# EAGLE schematic TestV1 (EAGLE 9.2.2)

## Sheet 1 of 9: Light Sensor Circuit
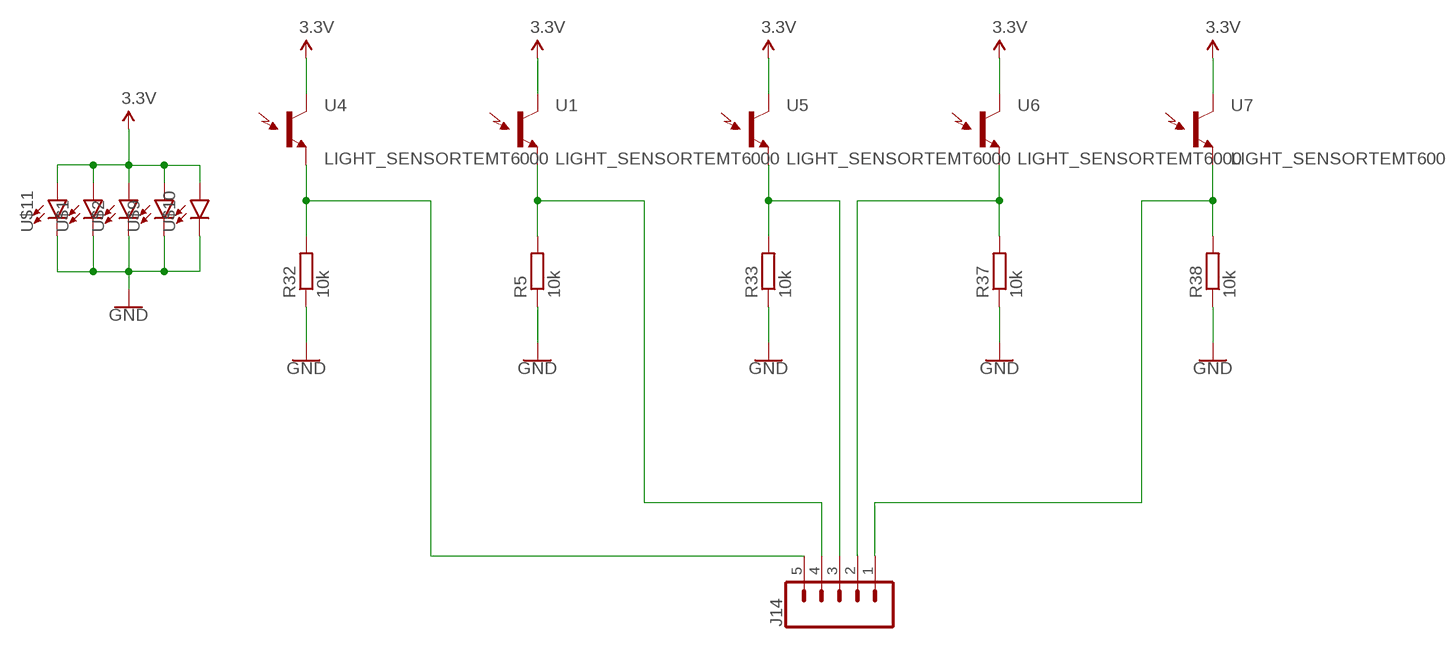
[diagram p0: schematic, sheet 1]

### Parts
J14  CONN_05LOCK  [1X05_LOCK]
R5  10k  R-EU_R0603  [R0603]
R32  10k  R-EU_R0603  [R0603]
R33  10k  R-EU_R0603  [R0603]
R37  10k  R-EU_R0603  [R0603]
R38  10k  R-EU_R0603  [R0603]
U1  LIGHT_SENSORTEMT6000  [TEMT6000]
U4  LIGHT_SENSORTEMT6000  [TEMT6000]
U5  LIGHT_SENSORTEMT6000  [TEMT6000]
U6  LIGHT_SENSORTEMT6000  [TEMT6000]
U7  LIGHT_SENSORTEMT6000  [TEMT6000]
U$1  3528LED  [3528]
U$2  3528LED  [3528]
U$9  3528LED  [3528]
U$10  3528LED  [3528]
U$11  3528LED  [3528]

### Nets
3.3V: U1.COLLECTOR(C1) U4.COLLECTOR(C1) U5.COLLECTOR(C1) U6.COLLECTOR(C1) U7.COLLECTOR(C1) U$1.A U$2.A U$9.A U$10.A U$11.A ; also sheet 2,3,4,6,7,8,9
GND: R5.1 R32.1 R33.1 R37.1 R38.1 U$1.C U$2.C U$9.C U$10.C U$11.C ; also sheet 2,3,4,5,6,7,8,9
N$65: J14.4 R5.2 U1.EMITTER(E1)
N$66: J14.3 R33.2 U5.EMITTER(E1)
N$67: J14.2 R37.2 U6.EMITTER(E1)
N$68: J14.1 R38.2 U7.EMITTER(E1)
N$69: J14.5 R32.2 U4.EMITTER(E1)

## Sheet 2 of 9: TPS5450 Buck Circuit
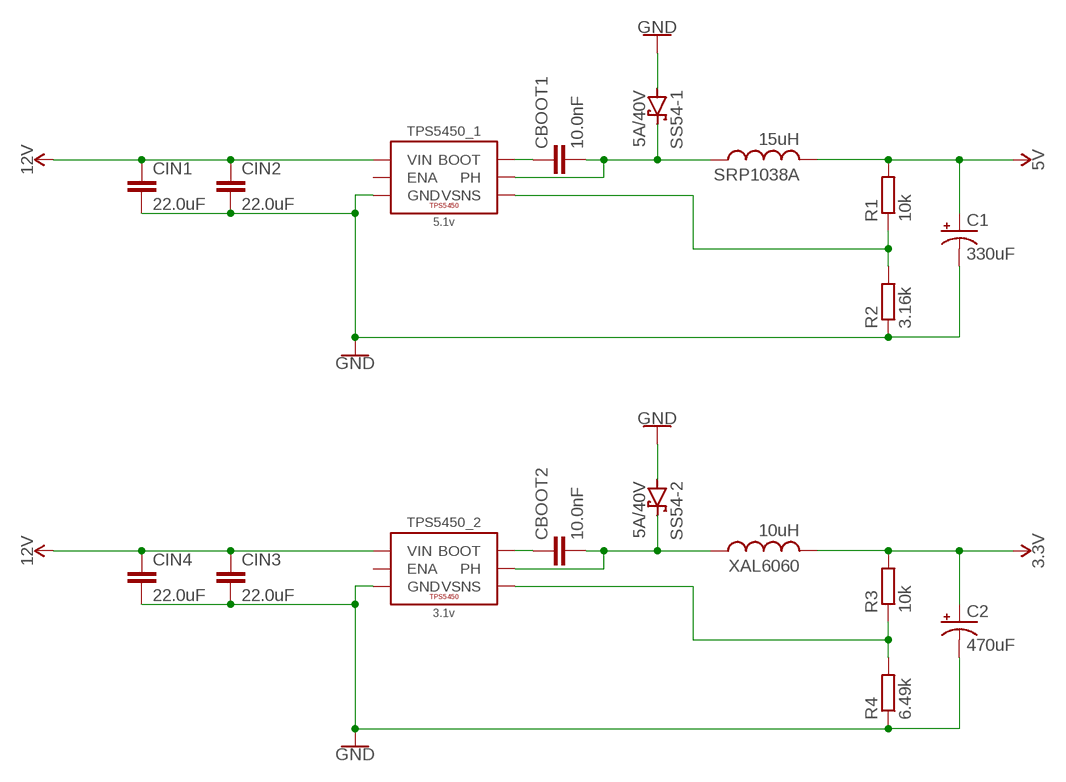
[diagram p1: schematic, sheet 2]

### Parts
C1  330uF  CPOL-USD/7343-31R  [D/7343-31R]
C2  470uF  CPOL-USD/7343-31R  [D/7343-31R]
CBOOT1  10.0nF  C-EUC0603  [C0603]
CBOOT2  10.0nF  C-EUC0603  [C0603]
CIN1  22.0uF  C-EUC1210  [C1210]
CIN2  22.0uF  C-EUC1210  [C1210]
CIN3  22.0uF  C-EUC1210  [C1210]
CIN4  22.0uF  C-EUC1210  [C1210]
R1  10k  R-EU_R0603  [R0603]
R2  3.16k  R-EU_R0603  [R0603]
R3  10k  R-EU_R0603  [R0603]
R4  6.49k  R-EU_R0603  [R0603]
SRP1038A  15uH  SRP1038A  [SRP1038A]
SS54-1  5A/40V  SCHOTTKY-DIODESMD  [SMB]
SS54-2  5A/40V  SCHOTTKY-DIODESMD  [SMB]
TPS5450_1  5.1v  TPS5450  [POWERPAD-SOIC-8]
TPS5450_2  3.1v  TPS5450  [POWERPAD-SOIC-8]
XAL6060  10uH  XAL6060  [XAL6060]

### Nets
3.3V: C2.+ R3.2 XAL6060.2 ; also sheet 1,3,4,6,7,8,9
5V: C1.+ R1.2 SRP1038A.2 ; also sheet 3,6,9
12V: CIN1.1 CIN2.1 CIN3.1 CIN4.1 TPS5450_1.7(VIN) TPS5450_2.7(VIN) ; also sheet 3,4,5,9
GND: C1.- C2.- CIN1.2 CIN2.2 CIN3.2 CIN4.2 R2.1 R4.1 SS54-1.A SS54-2.A TPS5450_1.6(GND) TPS5450_1.9(GND) TPS5450_2.6(GND) TPS5450_2.9(GND) ; also sheet 1,3,4,5,6,7,8,9
N$1: CBOOT1.2 SRP1038A.1 SS54-1.C TPS5450_1.8(PH)
N$2: CBOOT2.1 TPS5450_2.1(BOOT)
N$3: CBOOT1.1 TPS5450_1.1(BOOT)
N$4: R1.1 R2.2 TPS5450_1.4(VSNS)
N$5: CBOOT2.2 SS54-2.C TPS5450_2.8(PH) XAL6060.1
N$6: R3.1 R4.2 TPS5450_2.4(VSNS)
Unconnected: TPS5450_1.2(NC) TPS5450_1.3(NC) TPS5450_1.5(ENA) TPS5450_2.2(NC) TPS5450_2.3(NC) TPS5450_2.5(ENA)

## Sheet 3 of 9: MAX1522 Boost Converter Circuit
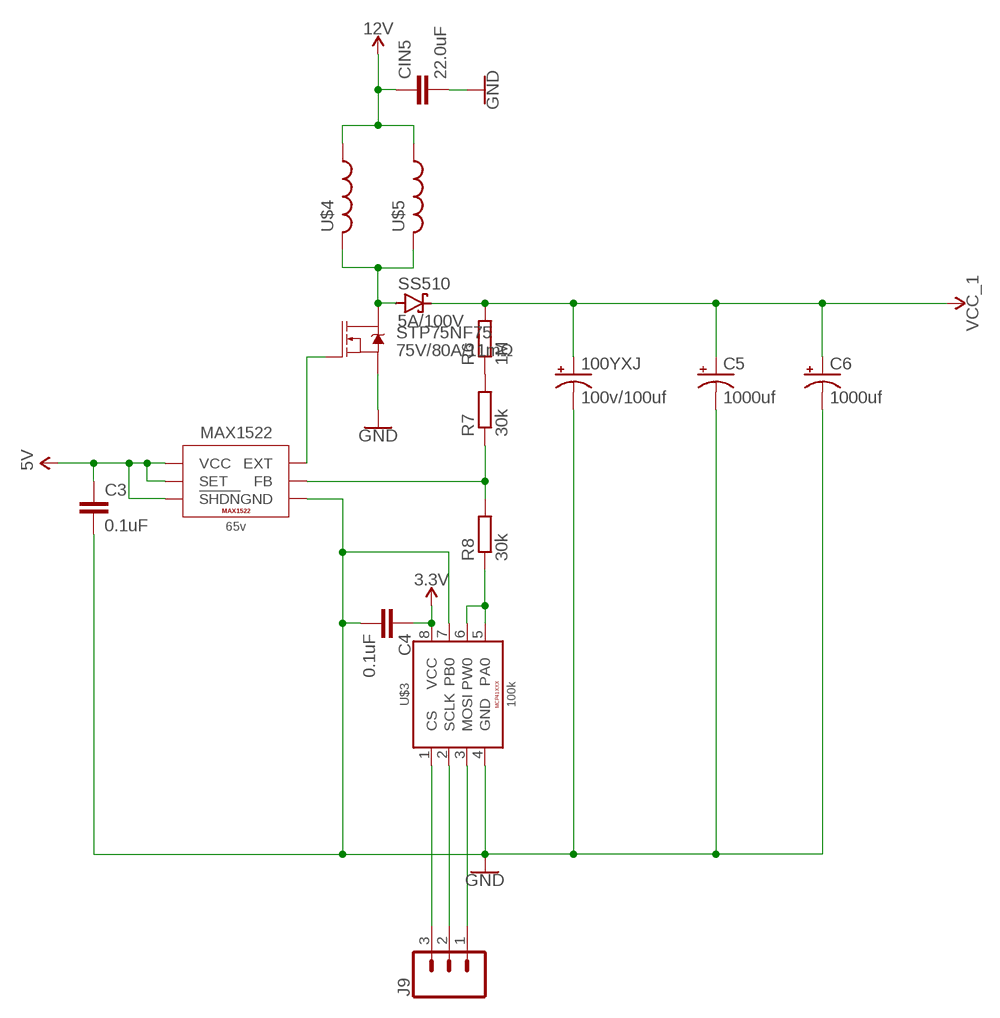
[diagram p2: schematic, sheet 3]

### Parts
100YXJ  100v/100uf  CPOL-USE5-10.5  [E5-10,5]
C3  0.1uF  C-EUC0603  [C0603]
C4  0.1uF  C-EUC0603  [C0603]
C5  1000uf  100UF-CAP  [1000UF-CAP]
C6  1000uf  100UF-CAP  [1000UF-CAP]
CIN5  22.0uF  C-EUC1210  [C1210]
J9  CONN_03LOCK  [1X03_LOCK]
MAX1522  65v  MAX1522EUT+T  [SOT23-6]
R6  1M  R-EU_R0603  [R0603]
R7  30k  R-EU_R0603  [R0603]
R8  30k  R-EU_R0603  [R0603]
SS510  5A/100V  SCHOTTKY-DIODESMD  [SMB]
STP75NF75  75V/80A/11mΩ  MOSFET-NCH-FQP30N06L  [TO220V]
U$3  100k  MCP41XXX  [SOIC-8]
U$4  CDRH127  [127]
U$5  CDRH127  [127]

### Nets
3.3V: C4.1 U$3.8(VCC) ; also sheet 1,2,4,6,7,8,9
5V: C3.1 MAX1522.3(SET) MAX1522.4(!SHDN) MAX1522.6(VCC) ; also sheet 2,6,9
12V: CIN5.1 U$4.1 U$5.1 ; also sheet 2,4,5,9
GND: 100YXJ.- C3.2 C4.2 C5.- C6.- CIN5.2 MAX1522.1(GND) STP75NF75.3(S) U$3.4(GND) U$3.7(PB0) ; also sheet 1,2,4,5,6,7,8,9
N$7: R6.1 R7.2
N$8: MAX1522.2(FB) R7.1 R8.2
N$9: MAX1522.5(EXT) STP75NF75.1(G)
N$10: R8.1 U$3.5(PA0) U$3.6(PW0)
N$11: SS510.A STP75NF75.2(D) U$4.2 U$5.2
N$37: J9.3 U$3.1(CS)
N$38: J9.2 U$3.2(SCLK)
N$39: J9.1 U$3.3(MOSI)
VCC_1: 100YXJ.+ C5.+ C6.+ R6.2 SS510.C ; also sheet 5,9

## Sheet 4 of 9: VNH5050 Motor Driver Circuit
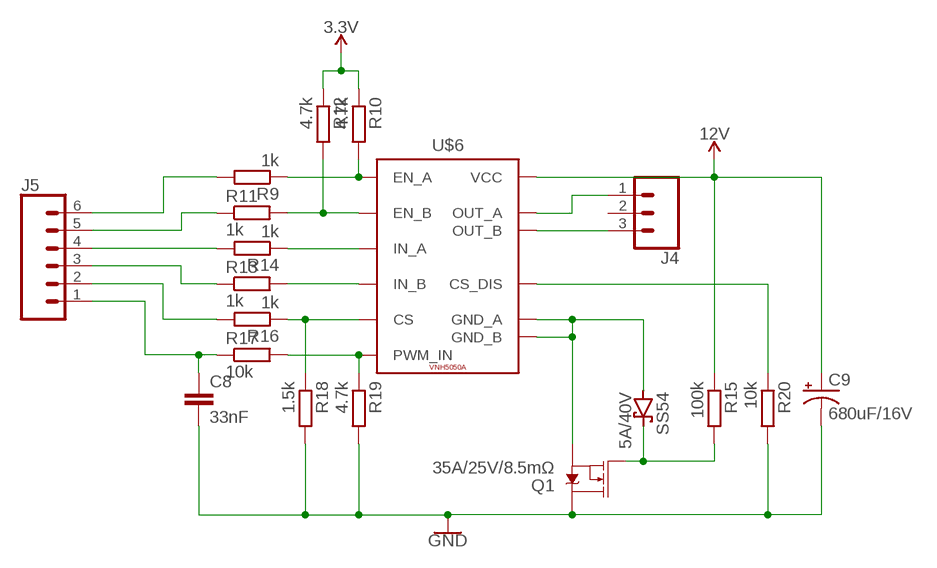
[diagram p3: schematic, sheet 4]

### Parts
C8  33nF  C-EUC0603  [C0603]
C9  680uF/16V  CPOL-USE3.5-8  [E3,5-8]
J4  CONN_03-SCREW-5MM  [SCREWTERMINAL-5MM-3]
J5  CONN_06LOCK  [1X06_LOCK]
Q1  35A/25V/8.5mΩ  MOSFET-NCH-FDD8780  [DPAK]
R9  1k  R-EU_R0603  [R0603]
R10  4.7k  R-EU_R0603  [R0603]
R11  1k  R-EU_R0603  [R0603]
R12  4.7k  R-EU_R0603  [R0603]
R13  1k  R-EU_R0603  [R0603]
R14  1k  R-EU_R0603  [R0603]
R15  100k  R-EU_R0603  [R0603]
R16  1k  R-EU_R0603  [R0603]
R17  10k  R-EU_R0603  [R0603]
R18  1.5k  R-EU_R0603  [R0603]
R19  4.7k  R-EU_R0603  [R0603]
R20  10k  R-EU_R0603  [R0603]
SS54  5A/40V  SCHOTTKY-DIODESMD  [SMB]
U$6  VNH5050A  [POWERSSO-36]

### Nets
3.3V: R10.1 R12.1 ; also sheet 1,2,3,6,7,8,9
12V: C9.+ R15.1 U$6.1(VCC) U$6.P13(VCC) U$6.P24(VCC) ; also sheet 2,3,5,9
CS: J5.2 R16.2
EN_A: J5.6 R9.2
EN_B: J5.5 R11.1
GND: C8.2 C9.- Q1.4(D) R18.2 R19.2 R20.2 ; also sheet 1,2,3,5,6,7,8,9
IN_A: J5.4 R14.2
IN_B: J5.3 R13.1
N$12: R9.1 R10.2 U$6.P16(EN_A)
N$13: R14.1 U$6.P15(IN_A)
N$14: R11.2 R12.2 U$6.P21(EN_B)
N$15: R13.2 U$6.P22(IN_B)
N$16: R17.2 R19.1 U$6.P17(PWM_IN)
N$17: R16.1 R18.1 U$6.P19(CS)
N$19: Q1.3(S) SS54.A U$6.P1(GND_A) U$6.P3(GND_A) U$6.P4(GND_A) U$6.P5(GND_A) U$6.P6(GND_A) U$6.P7(GND_A) U$6.P30(GND_B) U$6.P31(GND_B) U$6.P32(GND_B) U$6.P33(GND_B) U$6.P34(GND_B) U$6.P36(GND_B)
N$20: Q1.1(G) R15.2 SS54.C
N$21: R20.1 U$6.P20(CS_DIS)
OUT_A: J4.1 U$6.2(OUT_A) U$6.P2(OUT_A) U$6.P8(OUT_A) U$6.P9(OUT_A) U$6.P10(OUT_A) U$6.P11(OUT_A) U$6.P12(OUT_A) U$6.P14(OUT_A)
OUT_B: J4.3 U$6.3(OUT_B) U$6.P23(OUT_B) U$6.P25(OUT_B) U$6.P26(OUT_B) U$6.P27(OUT_B) U$6.P28(OUT_B) U$6.P29(OUT_B) U$6.P35(OUT_B)
PWM: C8.1 J5.1 R17.1
Unconnected: J4.2 U$6.P18(NC)

## Sheet 5 of 9: Solenoid MOSFET Switch Circuit
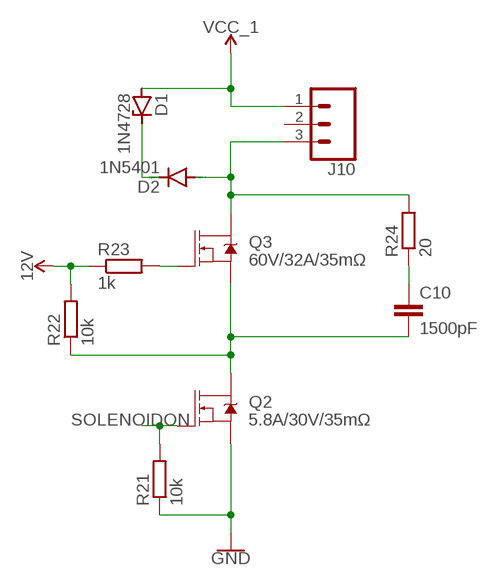
[diagram p4: schematic, sheet 5]

### Parts
C10  1500pF  C-EUC0603  [C0603]
D1  1N4728  [DO41Z10]
D2  1N5401  1N5400  [DO201-15]
J10  CONN_03-SCREW-5MM  [SCREWTERMINAL-5MM-3]
Q2  5.8A/30V/35mΩ  MOSFET-NCH-AO3404A  [SOT23-3]
Q3  60V/32A/35mΩ  MOSFET-NCH-FQP30N06L  [TO220V]
R21  10k  R-EU_R0603  [R0603]
R22  10k  R-EU_R0603  [R0603]
R23  1k  R-EU_R0603  [R0603]
R24  20  R-EU_R0603  [R0603]

### Nets
12V: R22.2 R23.1 ; also sheet 2,3,4,9
GND: Q2.2(S) R21.1 ; also sheet 1,2,3,4,6,7,8,9
N$22: C10.2 Q2.3(D) Q3.3(S) R22.1
N$23: Q3.1(G) R23.2
N$24: D1.C D2.C
N$26: C10.1 R24.1
SOLENOID-: D2.A J10.3 Q3.2(D) R24.2
SOLENOIDON: Q2.1(G) R21.2 ; also sheet 6
VCC_1: D1.A J10.1 ; also sheet 3,9
Unconnected: J10.2

## Sheet 6 of 9: STM32 "New Pill" Circuit
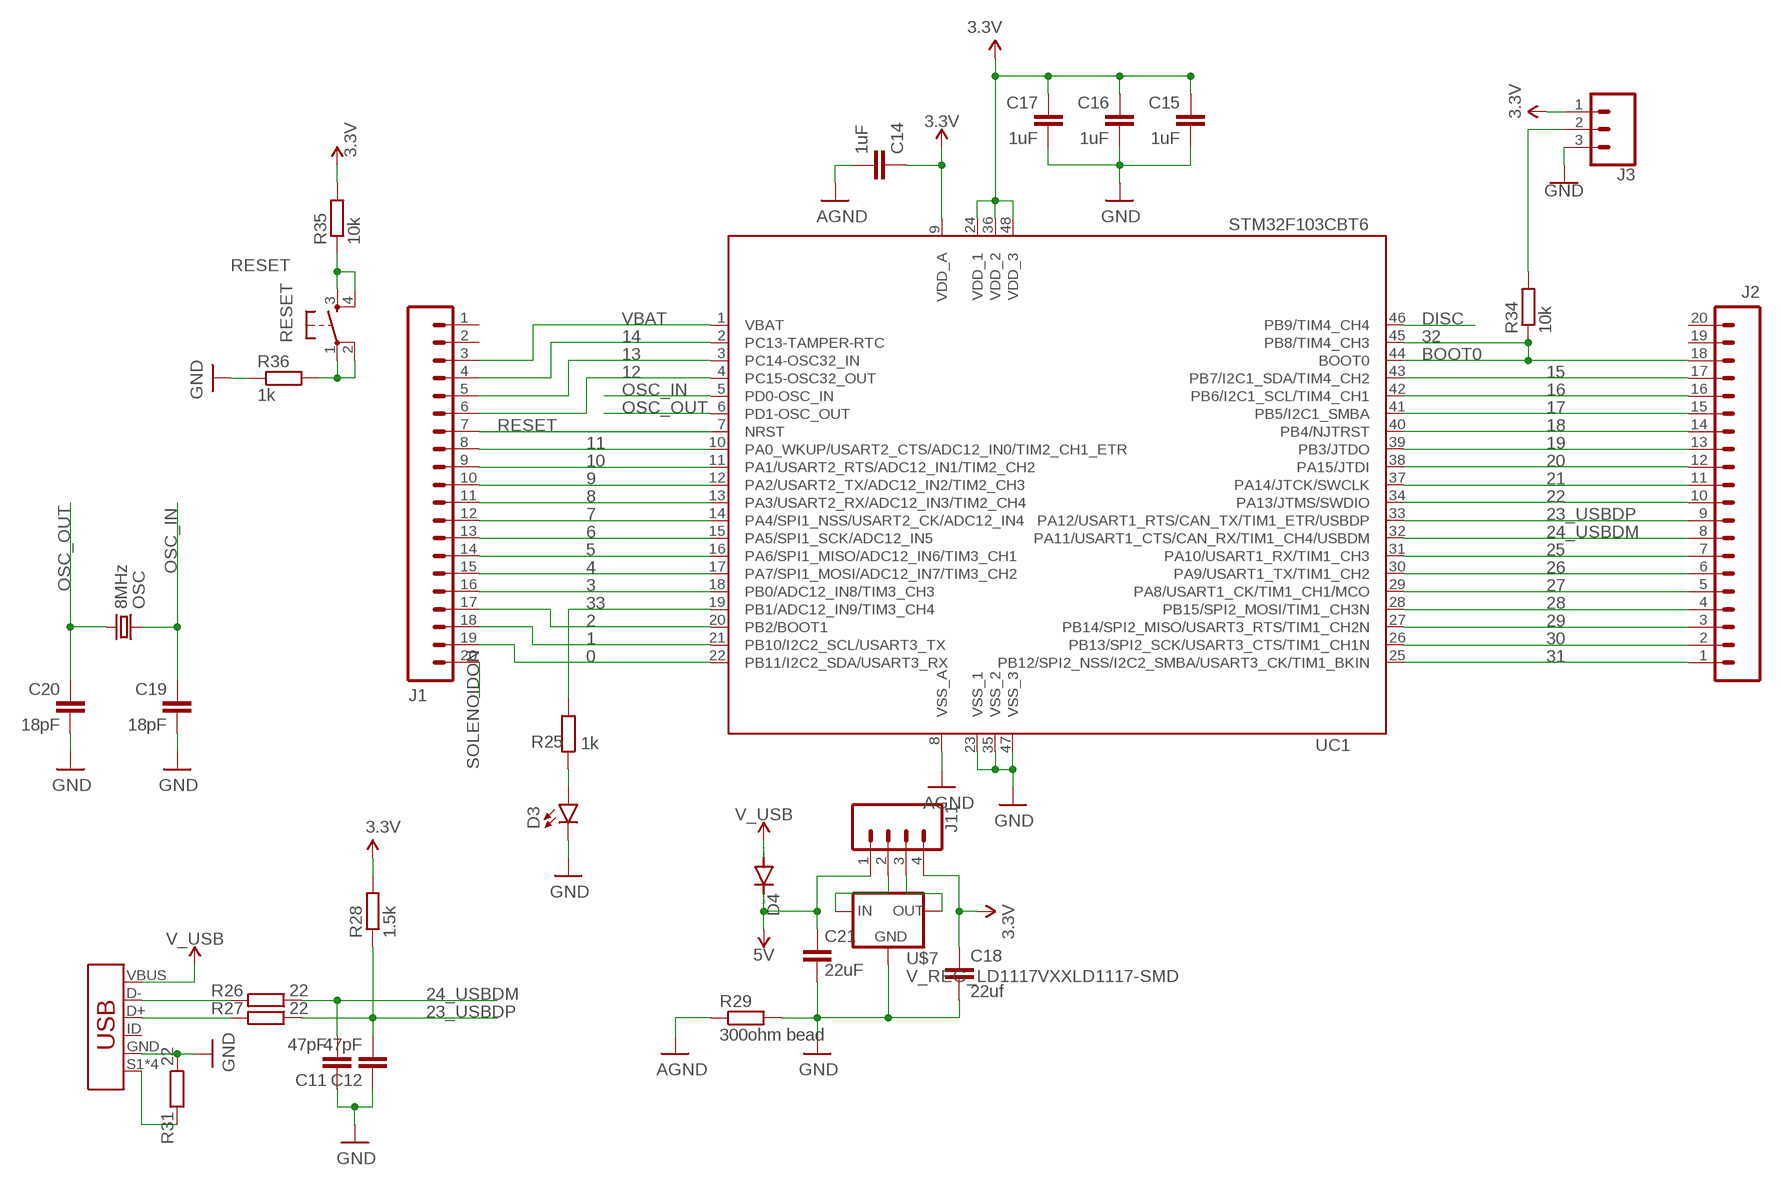
[diagram p5: schematic, sheet 6]

### Parts
C11  47pF  C-EUC0603  [C0603]
C12  47pF  C-EUC0603  [C0603]
C14  1uF  C-EUC0603  [C0603]
C15  1uF  C-EUC0603  [C0603]
C16  1uF  C-EUC0603  [C0603]
C17  1uF  C-EUC0603  [C0603]
C18  22uf  C-EUC1210  [C1210]
C19  18pF  C-EUC0603  [C0603]
C20  18pF  C-EUC0603  [C0603]
C21  22uF  C-EUC1210  [C1210]
D3  RED  LED-RED1206  [LED-1206]
D4  DIODE-DO-214AC  [DO-214AC]
J1  CONN_20LOCK  [1X20_LOCK]
J2  CONN_20LOCK  [1X20_LOCK]
J3  CONN_03LOCK  [1X03_LOCK]
J11  CONN_04LOCK  [1X04_LOCK]
OSC  8MHz  CRYSTALSMD-HC49UP  [HC49UP]
R25  1k  R-EU_R0603  [R0603]
R26  22  R-EU_R0603  [R0603]
R27  22  R-EU_R0603  [R0603]
R28  1.5k  R-EU_R0603  [R0603]
R29  300ohm bead  R-EU_R0402  [R0402]
R31  22  R-EU_R0603  [R0603]
R34  10k  R-EU_R0603  [R0603]
R35  10k  R-EU_R0603  [R0603]
R36  1k  R-EU_R0603  [R0603]
RESET  TAC_SWITCHSMD  [TACTILE-SWITCH-SMD]
U$7  V_REG_LD1117VXXLD1117-SMD  [SOT223]
UC1  STM32F103CBT6  STM32F103CB  [LQFP48]
X1  USB-MINIB  USB_MINI-B_SMT  [USB-MINIB]

### Nets
0: J1.19 UC1.22(PB11/I2C2_SDA/USART3_RX)
1: J1.18 UC1.21(PB10/I2C2_SCL/USART3_TX)
2: J1.17 UC1.20(PB2/BOOT1)
3: J1.16 UC1.18(PB0/ADC12_IN8/TIM3_CH3)
3.3V: C14.1 C15.1 C16.1 C17.1 C18.1 J3.1 J11.4 R35.2 UC1.9(VDD_A) UC1.24(VDD_1) UC1.36(VDD_2) UC1.48(VDD_3) ; also sheet 1,2,3,4,7,8,9
4: J1.15 UC1.17(PA7/SPI1_MOSI/ADC12_IN7/TIM3_CH2)
5: J1.14 UC1.16(PA6/SPI1_MISO/ADC12_IN6/TIM3_CH1)
5V: C21.1 D4.C J11.1 ; also sheet 2,3,9
6: J1.13 UC1.15(PA5/SPI1_SCK/ADC12_IN5)
7: J1.12 UC1.14(PA4/SPI1_NSS/USART2_CK/ADC12_IN4)
8: J1.11 UC1.13(PA3/USART2_RX/ADC12_IN3/TIM2_CH4)
9: J1.10 UC1.12(PA2/USART2_TX/ADC12_IN2/TIM2_CH3)
10: J1.9 UC1.11(PA1/USART2_RTS/ADC12_IN1/TIM2_CH2)
11: J1.8 UC1.10(PA0_WKUP/USART2_CTS/ADC12_IN0/TIM2_CH1_ETR)
12: J1.6 UC1.4(PC15-OSC32_OUT)
13: J1.5 UC1.3(PC14-OSC32_IN)
14: J1.4 UC1.2(PC13-TAMPER-RTC)
15: J2.17 UC1.43(PB7/I2C1_SDA/TIM4_CH2)
16: J2.16 UC1.42(PB6/I2C1_SCL/TIM4_CH1)
17: J2.15 UC1.41(PB5/I2C1_SMBA)
18: J2.14 UC1.40(PB4/NJTRST)
19: J2.13 UC1.39(PB3/JTDO)
20: J2.12 UC1.38(PA15/JTDI)
21: J2.11 UC1.37(PA14/JTCK/SWCLK)
22: J2.10 UC1.34(PA13/JTMS/SWDIO)
23_USBDP: C12.2 J2.9 R27.1 R28.1 UC1.33(PA12/USART1_RTS/CAN_TX/TIM1_ETR/USBDP)
24_USBDM: C11.2 J2.8 R26.1 UC1.32(PA11/USART1_CTS/CAN_RX/TIM1_CH4/USBDM)
25: J2.7 UC1.31(PA10/USART1_RX/TIM1_CH3)
26: J2.6 UC1.30(PA9/USART1_TX/TIM1_CH2)
27: J2.5 UC1.29(PA8/USART1_CK/TIM1_CH1/MCO)
28: J2.4 UC1.28(PB15/SPI2_MOSI/TIM1_CH3N)
29: J2.3 UC1.27(PB14/SPI2_MISO/USART3_RTS/TIM1_CH2N)
30: J2.2 UC1.26(PB13/SPI2_SCK/USART3_CTS/TIM1_CH1N)
31: J2.1 UC1.25(PB12/SPI2_NSS/I2C2_SMBA/USART3_CK/TIM1_BKIN)
32: J2.18 R34.1 UC1.44(BOOT0) UC1.45(PB8/TIM4_CH3)
33: R25.2 UC1.19(PB1/ADC12_IN9/TIM3_CH4)
AGND: C14.2 R29.1 UC1.8(VSS_A) ; also sheet 9
DGND: C11.1 C12.1 C18.2 C19.2 C20.2 C21.2 D3.C R29.2 R36.1 U$7.1(GND) UC1.23(VSS_1) UC1.35(VSS_2) UC1.47(VSS_3) ; supply symbol labelled GND
DISC: UC1.46(PB9/TIM4_CH4)
GND: C15.2 C16.2 C17.2 J3.3 R31.1 X1.GND ; also sheet 1,2,3,4,5,7,8,9
N$18: J11.2 U$7.3(IN)
N$27: R36.2 RESET.1 RESET.2
N$28: D3.A R25.1
N$30: J3.2 R34.2
N$36: R31.2 X1.S1(SHIELD) X1.S2(SHIELD) X1.S3(SHIELD) X1.S4(SHIELD)
N$41: J11.3 U$7.2(OUT)
N$51: R28.2 ; supply symbol labelled 3.3V
N$59: R26.2 X1.D-
N$60: R27.2 X1.D+
OSC_IN: C19.1 OSC.2 UC1.5(PD0-OSC_IN)
OSC_OUT: C20.1 OSC.1 UC1.6(PD1-OSC_OUT)
RESET: J1.7 R35.1 RESET.3 RESET.4 UC1.7(NRST)
SOLENOIDON: J1.20 ; also sheet 5
V_USB: D4.A X1.VBUS
VBAT: J1.3 UC1.1(VBAT)
Unconnected: J1.1 J1.2 J2.19 J2.20 X1.ID

### Notes on the sheet
- BOOT0

## Sheet 7 of 9: Analog MUX Circuit
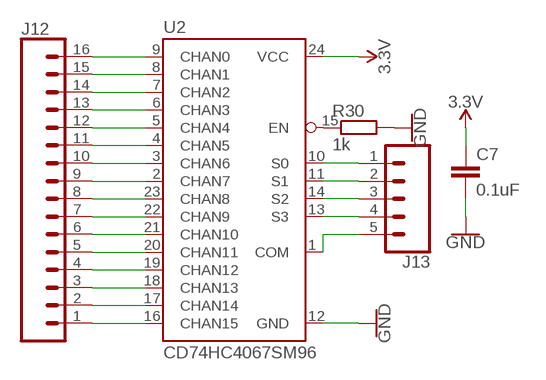
[diagram p6: schematic, sheet 7]

### Parts
C7  0.1uF  C-EUC0603  [C0603]
J12  CONN_16LOCK  [1X16_LOCK]
J13  CONN_05LOCK  [1X05_LOCK]
R30  1k  R-EU_R0603  [R0603]
U2  CD74HC4067SM96  74HC4067SM96  [SSOP24]

### Nets
3.3V: C7.1 U2.24(VCC) ; also sheet 1,2,3,4,6,8,9
GND: C7.2 R30.2 U2.12(GND) ; also sheet 1,2,3,4,5,6,8,9
N$25: R30.1 U2.15(EN)
N$40: J12.1 U2.16(CHAN15)
N$42: J12.2 U2.17(CHAN14)
N$43: J12.3 U2.18(CHAN13)
N$44: J12.4 U2.19(CHAN12)
N$45: J12.5 U2.20(CHAN11)
N$46: J12.6 U2.21(CHAN10)
N$47: J12.7 U2.22(CHAN9)
N$48: J12.8 U2.23(CHAN8)
N$49: J12.9 U2.2(CHAN7)
N$50: J12.10 U2.3(CHAN6)
N$52: J12.11 U2.4(CHAN5)
N$53: J12.12 U2.5(CHAN4)
N$54: J12.13 U2.6(CHAN3)
N$55: J12.14 U2.7(CHAN2)
N$56: J12.15 U2.8(CHAN1)
N$57: J12.16 U2.9(CHAN0)
N$58: J13.1 U2.10(S0)
N$61: J13.2 U2.11(S1)
N$62: J13.3 U2.14(S2)
N$63: J13.4 U2.13(S3)
N$64: J13.5 U2.1(COM)

## Sheet 8 of 9: ADXL345 Accelerometer Circuit
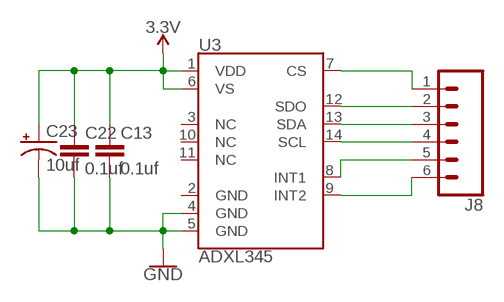
[diagram p7: schematic, sheet 8]

### Parts
C13  0.1uf  C-EUC0603  [C0603]
C22  0.1uf  C-EUC0603  [C0603]
C23  10uf  CPOL-USA/3216-18R  [A/3216-18R]
J8  CONN_06LOCK  [1X06_LOCK]
U3  ADXL345  [LGA-14]

### Nets
3.3V: C13.1 C22.1 C23.+ U3.1(VDD) U3.6(VS) ; also sheet 1,2,3,4,6,7,9
GND: C13.2 C22.2 C23.- U3.4(GND) U3.5(GND) ; also sheet 1,2,3,4,5,6,7,9
N$29: J8.1 U3.7(CS)
N$31: J8.2 U3.12(SDO)
N$32: J8.3 U3.13(SDA)
N$33: J8.4 U3.14(SCL)
N$34: J8.5 U3.8(INT1)
N$35: J8.6 U3.9(INT2)
Unconnected: U3.2(GND) U3.3(NC) U3.10(NC) U3.11(NC)

## Sheet 9 of 9: Power Input / Outputs
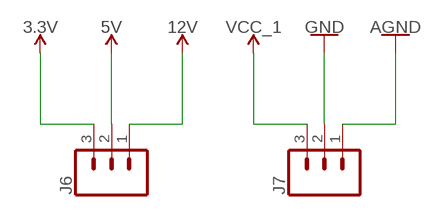
[diagram p8: schematic, sheet 9]

### Parts
J6  CONN_03-SCREW-5MM  [SCREWTERMINAL-5MM-3]
J7  CONN_03-SCREW-5MM  [SCREWTERMINAL-5MM-3]

### Nets
3.3V: J6.3 ; also sheet 1,2,3,4,6,7,8
5V: J6.2 ; also sheet 2,3,6
12V: J6.1 ; also sheet 2,3,4,5
AGND: J7.1 ; also sheet 6
GND: J7.2 ; also sheet 1,2,3,4,5,6,7,8
VCC_1: J7.3 ; also sheet 3,5

## Library data of the parts
100YXJ C1 C2 C9 C23 = rcl:CPOL-US: POLARIZED CAPACITOR, American symbol; SPICEPREFIX: C
C3 C4 C7 C8 C10-C22 CBOOT1 CBOOT2 CIN1-CIN5 = rcl:C-EU: CAPACITOR, European symbol; SPICEPREFIX: C
C5 C6 = JH:100UF-CAP
D1 = diode:1N4728: Z DIODE 3.3 V, 1W, 5 percent
D2 = diode:1N5400: DIODE standard rectifier, 3 A, 50 V (Motorola)
D3 = SparkFun-LED:LED-RED: Red SMD LED Used in manufacturing of most products at SparkFun Packages: 0603 - SMD 0603 package [Product Link] <http://docs.avagotech.com/docs/AV02-0551EN> 0603 SMART - SMD 0603 SMART package ( more efficient and expensive)[Product Link] <http://www.osram-os.com/Graphics/XPic2/00077099_0.pdf> 1206 - SMD1206 package [Product Link] <https://www.sparkfun.com/datasheets/DevTools/LilyPad/Q150OVS4.pdff> SparkFun Products: Pro Mini 328 -5V <https://www.sparkfun.com/products/821> RedBoard <https://www.sparkfun.com/products/12757> IOIO-OTG <https://www.sparkfun.com/products/13613>; PROD_ID: DIO-09912
D4 = diode:DIODE-: DIODE
J1 J2 = SparkFun-Connectors:CONN_20: Multi connection point. Often used as Generic Header-pin footprint for 0.1 inch spaced/style header connections On any of the 0.1 inch spaced packages, you can populate with these: Break Away Headers - Straight <https://www.sparkfun.com/products/116> (PRT-00116) Break Away Male Headers - Right Angle <https://www.sparkfun.com/products/553> (PRT-00553) Female Headers <https://www.sparkfun.com/products/115> (PRT-00115) Break Away Headers - Machine Pin <https://www.sparkfun.com/products/117> (PRT-00117) Break Away Female Headers - Swiss Machine Pin <https://www.sparkfun.com/products/743> (PRT-00743) For SCREWTERMINALS and SPRING TERMINALS visit here: Screw Terimnals on SparkFun.com <https://www.sparkfun.com/search/results?term=Screw+Terminals> (5mm/3.5mm/2.54mm spacing) This device is also useful as a general connection point to wire up your design to another part of your project. Our various solder wires solder well into these plated through hole pads. Hook-Up Wire - Assortment (Stranded, 22 AWG) <https://www.sparkfun.com/products/11375> (PRT-11375) Hook-Up Wire - Assortment (Solid Core, 22 AWG) <https://www.sparkfun.com/products/11367> (PRT-11367) View the entire wire category on our website here <https://www.sparkfun.com/categories/141> Special notes: Molex polarized connector foot print use with SKU : PRT-08231 with associated crimp pins and housings. 1MM SMD Version SKU: PRT-10208 NOTES ON THE VARIANTS LOCK and LOCK_LONGPADS... This footprint was designed to help hold the alignment of a through-hole component (i.e. 6-pin header) while soldering it into place. You may notice that each hole has been shifted either up or down by 0.005 of an inch from it's more standard position (which is a perfectly straight line). This slight alteration caused the pins (the squares in the middle) to touch the edges of the holes. Because they are alternating, it causes a "brace" to hold the component in place. 0.005 has proven to be the perfect amount of "off-center" position when using our standard breakaway headers. Although looks a little odd when you look at the bare footprint, once you have a header in there, the alteration is very hard to notice. Also,if you push a header all the way into place, it is covered up entirely on the bottom side. Note about LOCK SPECIAL package: This is just like the LOCK variant in that the holes are staggared by 5 mil, but except for the last two holes. They are not altered from the "standard" footprint layout. This is used for a special purpose on the layout of our Graphic LCD Backpack. Make sure you want to use this device before selecting it for you project!
J3 J9 = SparkFun-Connectors:CONN_03: Multi connection point. Often used as Generic Header-pin footprint for 0.1 inch spaced/style header connections On any of the 0.1 inch spaced packages, you can populate with these: Break Away Headers - Straight <https://www.sparkfun.com/products/116> (PRT-00116) Break Away Male Headers - Right Angle <https://www.sparkfun.com/products/553> (PRT-00553) Female Headers <https://www.sparkfun.com/products/115> (PRT-00115) Break Away Headers - Machine Pin <https://www.sparkfun.com/products/117> (PRT-00117) Break Away Female Headers - Swiss Machine Pin <https://www.sparkfun.com/products/743> (PRT-00743) Stackable Header - 3 Pin (Female, 0.1") <https://www.sparkfun.com/products/13875> (PRT-13875) For SCREWTERMINALS and SPRING TERMINALS visit here: Screw Terimnals on SparkFun.com <https://www.sparkfun.com/search/results?term=Screw+Terminals> (5mm/3.5mm/2.54mm spacing) This device is also useful as a general connection point to wire up your design to another part of your project. Our various solder wires solder well into these plated through hole pads. Hook-Up Wire - Assortment (Stranded, 22 AWG) <https://www.sparkfun.com/products/11375> (PRT-11375) Hook-Up Wire - Assortment (Solid Core, 22 AWG) <https://www.sparkfun.com/products/11367> (PRT-11367) View the entire wire category on our website here <https://www.sparkfun.com/categories/141> Special notes: Molex polarized connector foot print use with SKU : PRT-08232 with associated crimp pins and housings.
J4 J6 J7 J10 = SparkFun-Connectors:CONN_03: Multi connection point. Often used as Generic Header-pin footprint for 0.1 inch spaced/style header connections On any of the 0.1 inch spaced packages, you can populate with these: Break Away Headers - Straight <https://www.sparkfun.com/products/116> (PRT-00116) Break Away Male Headers - Right Angle <https://www.sparkfun.com/products/553> (PRT-00553) Female Headers <https://www.sparkfun.com/products/115> (PRT-00115) Break Away Headers - Machine Pin <https://www.sparkfun.com/products/117> (PRT-00117) Break Away Female Headers - Swiss Machine Pin <https://www.sparkfun.com/products/743> (PRT-00743) Stackable Header - 3 Pin (Female, 0.1") <https://www.sparkfun.com/products/13875> (PRT-13875) For SCREWTERMINALS and SPRING TERMINALS visit here: Screw Terimnals on SparkFun.com <https://www.sparkfun.com/search/results?term=Screw+Terminals> (5mm/3.5mm/2.54mm spacing) This device is also useful as a general connection point to wire up your design to another part of your project. Our various solder wires solder well into these plated through hole pads. Hook-Up Wire - Assortment (Stranded, 22 AWG) <https://www.sparkfun.com/products/11375> (PRT-11375) Hook-Up Wire - Assortment (Solid Core, 22 AWG) <https://www.sparkfun.com/products/11367> (PRT-11367) View the entire wire category on our website here <https://www.sparkfun.com/categories/141> Special notes: Molex polarized connector foot print use with SKU : PRT-08232 with associated crimp pins and housings.; PROD_ID: CONN-10134; SF_SKU: PRT-08433
J5 J8 = SparkFun-Connectors:CONN_06: Multi connection point. Often used as Generic Header-pin footprint for 0.1 inch spaced/style header connections On any of the 0.1 inch spaced packages, you can populate with these: Break Away Headers - Straight <https://www.sparkfun.com/products/116> (PRT-00116) Break Away Male Headers - Right Angle <https://www.sparkfun.com/products/553> (PRT-00553) Female Headers <https://www.sparkfun.com/products/115> (PRT-00115) Break Away Headers - Machine Pin <https://www.sparkfun.com/products/117> (PRT-00117) Break Away Female Headers - Swiss Machine Pin <https://www.sparkfun.com/products/743> (PRT-00743) Arduino Stackable Header - 6 Pin <https://www.sparkfun.com/products/9280> (PRT-09280) For SCREWTERMINALS and SPRING TERMINALS visit here: Screw Terimnals on SparkFun.com <https://www.sparkfun.com/search/results?term=Screw+Terminals> (5mm/3.5mm/2.54mm spacing) This device is also useful as a general connection point to wire up your design to another part of your project. Our various solder wires solder well into these plated through hole pads. Hook-Up Wire - Assortment (Stranded, 22 AWG) <https://www.sparkfun.com/products/11375> (PRT-11375) Hook-Up Wire - Assortment (Solid Core, 22 AWG) <https://www.sparkfun.com/products/11367> (PRT-11367) View the entire wire category on our website here <https://www.sparkfun.com/categories/141>
J11 = SparkFun-Connectors:CONN_04: Multi connection point. Often used as Generic Header-pin footprint for 0.1 inch spaced/style header connections On any of the 0.1 inch spaced packages, you can populate with these: Break Away Headers - Straight <https://www.sparkfun.com/products/116> (PRT-00116) Break Away Male Headers - Right Angle <https://www.sparkfun.com/products/553> (PRT-00553) Female Headers <https://www.sparkfun.com/products/115> (PRT-00115) Break Away Headers - Machine Pin <https://www.sparkfun.com/products/117> (PRT-00117) Break Away Female Headers - Swiss Machine Pin <https://www.sparkfun.com/products/743> (PRT-00743) For SCREWTERMINALS and SPRING TERMINALS visit here: Screw Terimnals on SparkFun.com <https://www.sparkfun.com/search/results?term=Screw+Terminals> (5mm/3.5mm/2.54mm spacing) This device is also useful as a general connection point to wire up your design to another part of your project. Our various solder wires solder well into these plated through hole pads. Hook-Up Wire - Assortment (Stranded, 22 AWG) <https://www.sparkfun.com/products/11375> (PRT-11375) Hook-Up Wire - Assortment (Solid Core, 22 AWG) <https://www.sparkfun.com/products/11367> (PRT-11367) View the entire wire category on our website here <https://www.sparkfun.com/categories/141> Special notes: Molex polarized connector foot print use with SKU : PRT-08231 with associated crimp pins and housings. 1MM SMD Version SKU: PRT-10208; PROD_ID: CONN-09696
J12 = SparkFun-Connectors:CONN_16: Multi connection point. Often used as Generic Header-pin footprint for 0.1 inch spaced/style header connections On any of the 0.1 inch spaced packages, you can populate with these: Break Away Headers - Straight <https://www.sparkfun.com/products/116> (PRT-00116) Break Away Male Headers - Right Angle <https://www.sparkfun.com/products/553> (PRT-00553) Female Headers <https://www.sparkfun.com/products/115> (PRT-00115) Break Away Headers - Machine Pin <https://www.sparkfun.com/products/117> (PRT-00117) Break Away Female Headers - Swiss Machine Pin <https://www.sparkfun.com/products/743> (PRT-00743) For SCREWTERMINALS and SPRING TERMINALS visit here: Screw Terimnals on SparkFun.com <https://www.sparkfun.com/search/results?term=Screw+Terminals> (5mm/3.5mm/2.54mm spacing) This device is also useful as a general connection point to wire up your design to another part of your project. Our various solder wires solder well into these plated through hole pads. Hook-Up Wire - Assortment (Stranded, 22 AWG) <https://www.sparkfun.com/products/11375> (PRT-11375) Hook-Up Wire - Assortment (Solid Core, 22 AWG) <https://www.sparkfun.com/products/11367> (PRT-11367) View the entire wire category on our website here <https://www.sparkfun.com/categories/141> Special notes: Molex polarized connector foot print use with SKU : PRT-08231 with associated crimp pins and housings. 1MM SMD Version SKU: PRT-10208 NOTES ON THE VARIANTS LOCK and LOCK_LONGPADS... This footprint was designed to help hold the alignment of a through-hole component (i.e. 6-pin header) while soldering it into place. You may notice that each hole has been shifted either up or down by 0.005 of an inch from it's more standard position (which is a perfectly straight line). This slight alteration caused the pins (the squares in the middle) to touch the edges of the holes. Because they are alternating, it causes a "brace" to hold the component in place. 0.005 has proven to be the perfect amount of "off-center" position when using our standard breakaway headers. Although looks a little odd when you look at the bare footprint, once you have a header in there, the alteration is very hard to notice. Also,if you push a header all the way into place, it is covered up entirely on the bottom side.
J13 J14 = SparkFun-Connectors:CONN_05: Multi connection point. Often used as Generic Header-pin footprint for 0.1 inch spaced/style header connections On any of the 0.1 inch spaced packages, you can populate with these: Break Away Headers - Straight <https://www.sparkfun.com/products/116> (PRT-00116) Break Away Male Headers - Right Angle <https://www.sparkfun.com/products/553> (PRT-00553) Female Headers <https://www.sparkfun.com/products/115> (PRT-00115) Break Away Headers - Machine Pin <https://www.sparkfun.com/products/117> (PRT-00117) Break Away Female Headers - Swiss Machine Pin <https://www.sparkfun.com/products/743> (PRT-00743) For SCREWTERMINALS and SPRING TERMINALS visit here: Screw Terimnals on SparkFun.com <https://www.sparkfun.com/search/results?term=Screw+Terminals> (5mm/3.5mm/2.54mm spacing) This device is also useful as a general connection point to wire up your design to another part of your project. Our various solder wires solder well into these plated through hole pads. Hook-Up Wire - Assortment (Stranded, 22 AWG) <https://www.sparkfun.com/products/11375> (PRT-11375) Hook-Up Wire - Assortment (Solid Core, 22 AWG) <https://www.sparkfun.com/products/11367> (PRT-11367) View the entire wire category on our website here <https://www.sparkfun.com/categories/141> Special notes: Molex polarized connector foot print use with SKU : PRT-08231 with associated crimp pins and housings. 1MM SMD Version SKU: PRT-10208
MAX1522 = JH:MAX1522EUT+T; MANUFACTURER_PART_NUMBER: MAX1522EUT+T; VENDOR: MAXIM
OSC = SparkFun-Clocks:CRYSTAL: Crystals (Generic) These are passive quartz crystals, which can be used as a clock source for a microcontroller. Crystal's are two-terminal devices. They require external "load" capacitors to generate an oscillating signal.
Q1 = SparkFun-DiscreteSemi:MOSFET-NCH: N-channel MOSFETs Voltage controlled devices that allow control of high current outputs. SparkFun Products: SparkFun OpenScale <https://www.sparkfun.com/products/13261> SparkFun Digital Sandbox <https://www.sparkfun.com/products/12651> SparkFun Monster Moto Shield <https://www.sparkfun.com/products/10182> SparkFun MOSFET Power Controller <https://www.sparkfun.com/products/11214>; PROD_ID: TRANS-09984
Q2 = SparkFun-DiscreteSemi:MOSFET-NCH: N-channel MOSFETs Voltage controlled devices that allow control of high current outputs. SparkFun Products: SparkFun OpenScale <https://www.sparkfun.com/products/13261> SparkFun Digital Sandbox <https://www.sparkfun.com/products/12651> SparkFun Monster Moto Shield <https://www.sparkfun.com/products/10182> SparkFun MOSFET Power Controller <https://www.sparkfun.com/products/11214>; PROD_ID: TRANS-12988
Q3 = SparkFun-DiscreteSemi:MOSFET-NCH: N-channel MOSFETs Voltage controlled devices that allow control of high current outputs. SparkFun Products: SparkFun OpenScale <https://www.sparkfun.com/products/13261> SparkFun Digital Sandbox <https://www.sparkfun.com/products/12651> SparkFun Monster Moto Shield <https://www.sparkfun.com/products/10182> SparkFun MOSFET Power Controller <https://www.sparkfun.com/products/11214>; PROD_ID: TRANS-10060
R1-R38 = rcl:R-EU_: RESISTOR, European symbol; SPICEPREFIX: R
RESET = SparkFun-Retired:TAC_SWITCH: Momentary Switch Button commonly used for reset or general input. Spark Fun Electronics SKU : COM-00097 SMT- SWCH-08247; PROD_ID: SWCH-08247
SRP1038A = JH:SRP1038A
SS54 SS54-1 SS54-2 SS510 = diode:SCHOTTKY-DIODE: Schottky Diode
STP75NF75 = SparkFun-DiscreteSemi:MOSFET-NCH: N-channel MOSFETs Voltage controlled devices that allow control of high current outputs. SparkFun Products: SparkFun OpenScale <https://www.sparkfun.com/products/13261> SparkFun Digital Sandbox <https://www.sparkfun.com/products/12651> SparkFun Monster Moto Shield <https://www.sparkfun.com/products/10182> SparkFun MOSFET Power Controller <https://www.sparkfun.com/products/11214>; PROD_ID: TRANS-10060; VALUE: 60V/32A/35mΩ
TPS5450_1 TPS5450_2 = JH:TPS5450
U1 U4-U7 = SparkFun-Sensors:LIGHT_SENSOR: Ambient Light Sensors - Phototransistors Low cost ambient light sensors, consisting of a phototransistor in miniature SMD packages. Output voltage varies with light intensity. SparkFun Products ALS-PT19 Light Sensor <https://www.sparkfun.com/products/12566> (SEN-12566) Ambient Light Sensor - TEMT6000 <https://www.sparkfun.com/products/8348> (SEN-08348) SparkFun Ambient Light Sensor Breakout - TEMT60000 <https://www.sparkfun.com/products/8688> (SEN-08688); PROD_ID: COMP-08569; SF_ID: COM-08348
U2 = SparkFun-IC-Logic:74*4067: 16-channel analog MUX Datasheet <http://www.sparkfun.com/datasheets/IC/cd74hc4067.pdf> SparkFun Products MP3 Trigger <https://www.sparkfun.com/products/13720> (WIG-13720) SparkFun Analog/Digital MUX Breakout - CD74HC4067 <https://www.sparkfun.com/products/9056> (BOB-09056); PROD_ID: IC-08252
U3 = SparkFun-Sensors:ADXL345: Analog Devices ADXL345 3-Axis SPI/I2C 2/4/8/16g Accelerometer The ADXL345 is a small, thin, low power, 3-axis accelerometer with high resolution (13-bit) measurement at up to ±16g. Digital output data is formatted as 16-bit twos complement and is accessible through either a SPI (3- or 4-wire) or I2C digital interface. Datasheet <https://www.sparkfun.com/datasheets/Sensors/Accelerometer/ADXL345.pdf> SparkFun Products SparkFun Triple Axis Accelerometer Breakout - ADXL345 <https://www.sparkfun.com/products/9836> (SEN-09836) Triple Axis Accelerometer - ADXL345 <https://www.sparkfun.com/products/9045> (SEN-09045) SparkFun 6 Degrees of Freedom IMU Digital Combo Board - ITG3200/ADXL345 <https://www.sparkfun.com/products/10121> (SEN-10121); PROD_ID: IC-09097; SF_ID: SEN-09045
U$1 U$2 U$9-U$11 = JH:3528LED
U$3 = JH:MCP41XXX
U$4 U$5 = JH:CDRH127
U$6 = JH:VNH5050A
U$7 = SparkFun-IC-Power:V_REG_LD1117VXX: LD1117VXX voltage regulator. We carry the 3.3V version (COM-00526) in TO-220 package.; PROD_ID: VREG-13917
UC1 = stm32:STM32F103CB
X1 = SparkFun-Connectors:USB_MINI-B: USB type Mini-B Connector Breaks out 5th pin, and includes shield pins if needed. SparkFun Products: SparkFun FTDI Basic Breakout <https://www.sparkfun.com/products/9716> SparkFun XBee Explorer USB <https://www.sparkfun.com/products/11812> SparkFun Redboard <https://www.sparkfun.com/products/12757>; PROD_ID: CONN-08193; SF_ID: PRT-00587
XAL6060 = JH:XAL6060